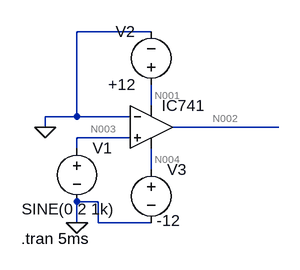
[diagram p0: schematic noninverting openloop.asc]
noninverting openloop.asc, the LTspice schematic file:
Version 4
SHEET 1 880 680
WIRE 208 32 96 32
WIRE 208 144 208 112
WIRE 96 160 96 32
WIRE 96 160 48 160
WIRE 176 160 96 160
WIRE 48 176 48 160
WIRE 400 176 240 176
WIRE 176 192 96 192
WIRE 96 208 96 192
WIRE 208 240 208 208
WIRE 128 288 96 288
WIRE 96 320 96 288
WIRE 128 320 128 288
WIRE 208 320 128 320
FLAG 48 176 0
FLAG 96 320 0
SYMBOL Opamps\\UniversalOpamp2 208 176 R0
SYMATTR InstName IC741
SYMBOL voltage 96 192 R0
WINDOW 3 -83 108 Left 2
WINDOW 123 0 0 Left 0
WINDOW 39 0 0 Left 0
SYMATTR Value SINE(0 2 1k)
SYMATTR InstName V1
SYMBOL voltage 208 128 R180
WINDOW 0 24 96 Left 2
WINDOW 3 24 16 Left 2
WINDOW 123 0 0 Left 0
WINDOW 39 0 0 Left 0
SYMATTR InstName V2
SYMATTR Value +12
SYMBOL voltage 208 224 R0
WINDOW 123 0 0 Left 0
WINDOW 39 0 0 Left 0
WINDOW 3 8 93 Left 2
SYMATTR InstName V3
SYMATTR Value -12
TEXT 12 344 Left 2 !.tran 5ms

The netlist it stands for:
* noninverting openloop.asc
XIC741 N003 0 N001 N004 N002 level.2 Avol=1Meg GBW=10Meg Slew=10Meg ilimit=25m rail=0 Vos=0 phimargin=45 en=0 enk=0 in=0 ink=0 Rin=500Meg  ; pins IN+ IN- V+ V- OUT
V1 N003 0 SINE(0 2 1k)
V2 N001 0 +12
V3 N004 0 -12
.tran 5ms
.lib UniversalOpamps2.sub
.backanno
.end

* Results of the author's LTspice run, read from the files saved beside the schematic
* Operating Point, zero values left out:
*   V(n001) = 12 V
*   V(n004) = -12 V
*   I(V3) = 1.199 mA
*   I(V2) = -1.199 mA
*   Ix(ic741:3) = 1.199 mA
*   Ix(ic741:4) = -1.199 mA
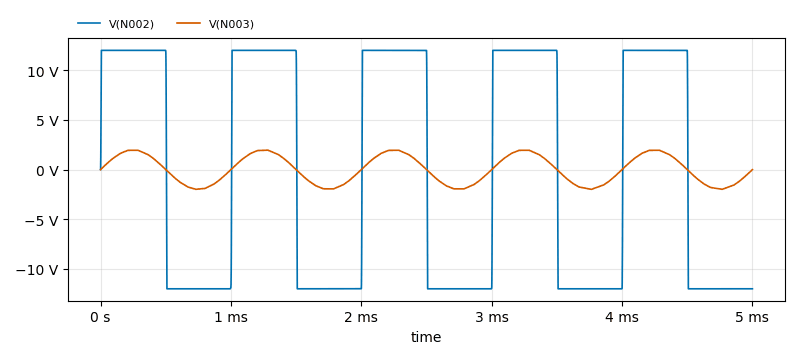
[diagram p1: Transient Analysis of noninverting openloop.asc, plotted from the saved traces]
* Transient Analysis, 1 run:
*   V(N002): min -12 V, max 12 V, average 16.8 mV, rms 11.95 V, last -12 V
*   V(N003): min -1.989 V, max 1.955 V, average 1.033 mV, rms 1.398 V, last 0 V